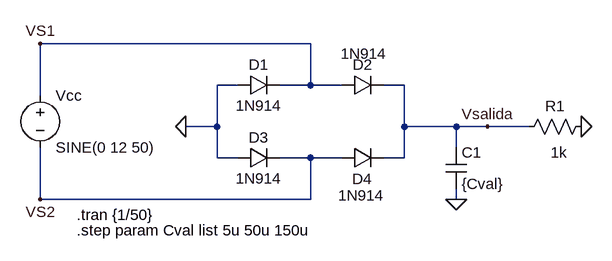
[diagram p0: schematic Punto 1, 2,.asc]
Punto 1, 2,.asc, the LTspice schematic file:
Version 4
SHEET 1 1748 680
WIRE 1120 176 704 176
WIRE 1008 240 976 240
WIRE 1120 240 1120 176
WIRE 1120 240 1072 240
WIRE 1168 240 1120 240
WIRE 1264 240 1232 240
WIRE 704 256 704 176
WIRE 976 304 976 240
WIRE 976 304 928 304
WIRE 1264 304 1264 240
WIRE 1344 304 1264 304
WIRE 1392 304 1344 304
WIRE 1456 304 1392 304
WIRE 1344 336 1344 304
WIRE 976 352 976 304
WIRE 1008 352 976 352
WIRE 1120 352 1072 352
WIRE 1168 352 1120 352
WIRE 1264 352 1264 304
WIRE 1264 352 1232 352
WIRE 704 416 704 336
WIRE 1120 416 1120 352
WIRE 1120 416 704 416
WIRE 1344 416 1344 400
FLAG 928 304 0
FLAG 1536 304 0
FLAG 704 176 VS1
FLAG 704 416 VS2
FLAG 1392 304 Vsalida
FLAG 1344 416 0
SYMBOL voltage 704 240 R0
WINDOW 123 0 0 Left 0
WINDOW 39 0 0 Left 0
SYMATTR InstName Vcc
SYMATTR Value SINE(0 12 50)
SYMBOL diode 1008 256 R270
WINDOW 0 32 32 VTop 2
WINDOW 3 0 32 VBottom 2
SYMATTR InstName D1
SYMATTR Value 1N914
SYMBOL diode 1168 256 R270
WINDOW 0 32 32 VTop 2
WINDOW 3 80 34 VBottom 2
SYMATTR InstName D2
SYMATTR Value 1N914
SYMBOL diode 1008 368 R270
WINDOW 0 32 32 VTop 2
WINDOW 3 0 32 VBottom 2
SYMATTR InstName D3
SYMATTR Value 1N914
SYMBOL diode 1168 368 R270
WINDOW 0 -32 31 VTop 2
WINDOW 3 -26 30 VBottom 2
SYMATTR InstName D4
SYMATTR Value 1N914
SYMBOL res 1552 288 R90
WINDOW 0 0 56 VBottom 2
WINDOW 3 40 50 VTop 2
SYMATTR InstName R1
SYMATTR Value 1k
SYMBOL cap 1328 336 R0
SYMATTR InstName C1
SYMATTR Value {Cval}
TEXT 760 440 Left 2 !.tran {1/50}
TEXT 760 464 Left 2 !.step param Cval list 5u 50u 150u

The netlist it stands for:
* Punto 1, 2,.asc
Vcc VS1 VS2 SINE(0 12 50)
D1 0 VS1 1N914
D2 VS1 Vsalida 1N914
D3 0 VS2 1N914
D4 VS2 Vsalida 1N914
R1 0 Vsalida 1k
C1 Vsalida 0 {Cval}
.model D D
.lib standard.dio
.tran {1/50}
.step param Cval list 5u 50u 150u
.backanno
.end